# Altium schematic sheet SelfDrivingCar_SCH_MotorDriver.SchDoc
size A; DocumentNumber: 6; SheetNumber: 5; SheetTotal: 7
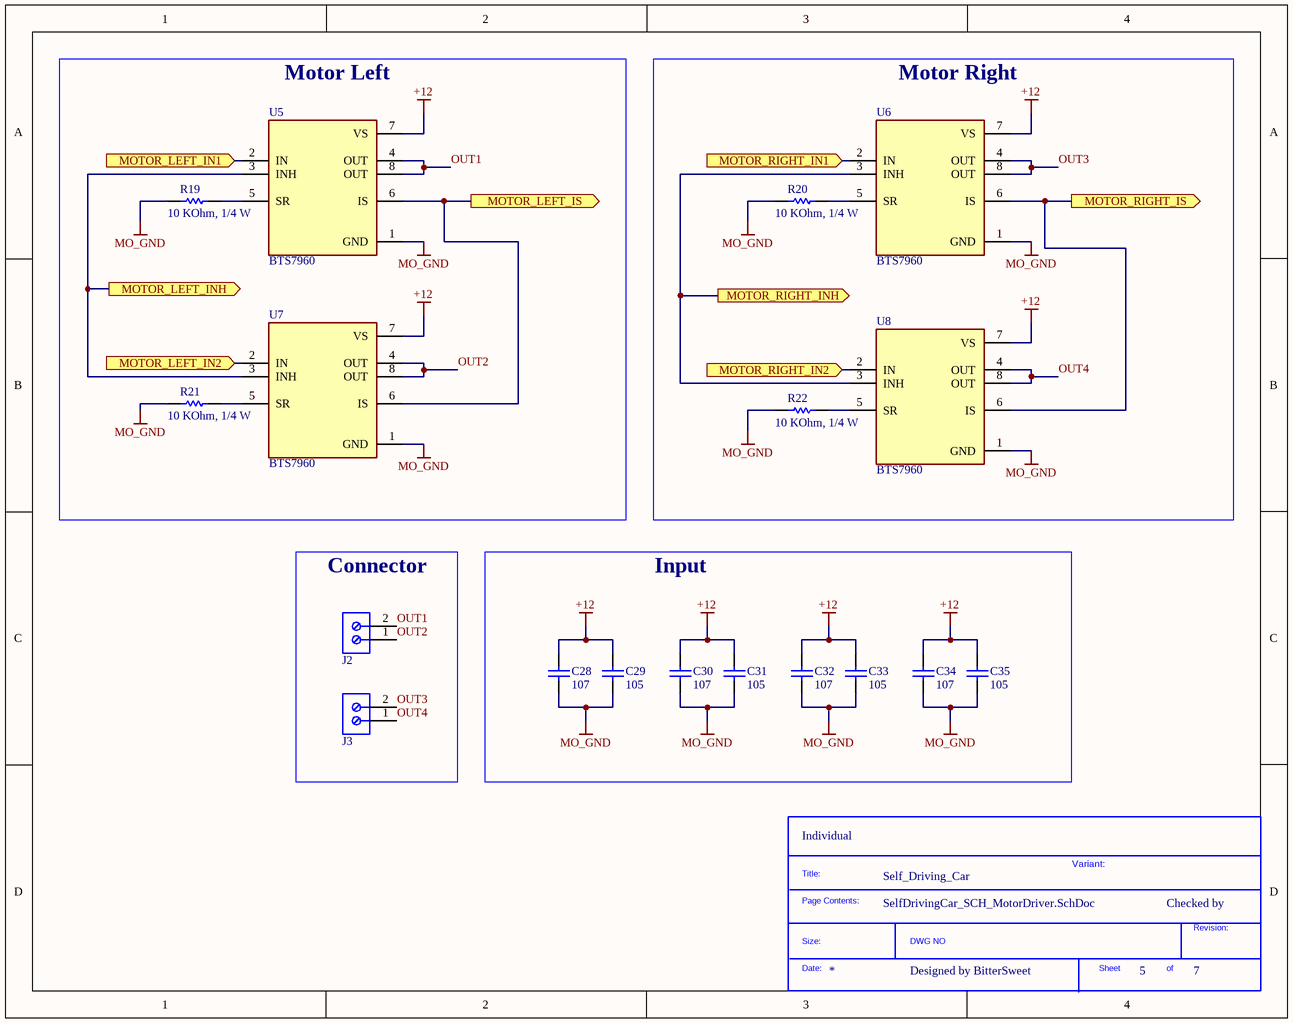
[diagram p0: SelfDrivingCar_SCH_MotorDriver.SchDoc]

## Parts
*?  SDTitleBlock  (value not drawn)  (graphical)
C28  107  [tu 1206]
C29  105  [tu 1206]
C30  107  [tu 1206]
C31  105  [tu 1206]
C32  107  [tu 1206]
C33  105  [tu 1206]
C34  107  [tu 1206]
C35  105  [tu 1206]
J2  16A, 300V  [691213710002]  (value not drawn)
J3  16A, 300V  [691213710002]  (value not drawn)
R19  10 KOhm, 1/4 W  [resistor_0603]
R20  10 KOhm, 1/4 W  [resistor_0603]
R21  10 KOhm, 1/4 W  [resistor_0603]
R22  10 KOhm, 1/4 W  [resistor_0603]
U5  BTS7960  [P-TO-263-7]
U6  BTS7960  [P-TO-263-7]
U7  BTS7960  [P-TO-263-7]
U8  BTS7960  [P-TO-263-7]

## Blocks framed on the sheet
Motor Left: R19 R21 U5 U7
Motor Right: R20 R22 U6 U8
Connector: J2 J3
Input: C28-C35

## Ports
MOTOR_LEFT_IN1 (in), MOTOR_LEFT_IN2 (in), MOTOR_LEFT_INH (out), MOTOR_LEFT_IS (out), MOTOR_RIGHT_IN1 (in), MOTOR_RIGHT_IN2 (in), MOTOR_RIGHT_INH (out), MOTOR_RIGHT_IS (out)

## Nets
+12: C28.1 C29.1 C30.1 C31.1 C32.1 C33.1 C34.1 C35.1 U5.7(VS) U6.7(VS) U7.7(VS) U8.7(VS)
MO_GND: C28.2 C29.2 C30.2 C31.2 C32.2 C33.2 C34.2 C35.2 R19.2 R20.2 R21.2 R22.2 U5.1(GND) U6.1(GND) U7.1(GND) U8.1(GND)
MOTOR_LEFT_IN1: U5.2(IN) ; port MOTOR_LEFT_IN1
MOTOR_LEFT_IN2: U7.2(IN) ; port MOTOR_LEFT_IN2
MOTOR_LEFT_INH: U5.3(INH) U7.3(INH) ; port MOTOR_LEFT_INH
MOTOR_LEFT_IS: U5.6(IS) U7.6(IS) ; port MOTOR_LEFT_IS
MOTOR_RIGHT_IN1: U6.2(IN) ; port MOTOR_RIGHT_IN1
MOTOR_RIGHT_IN2: U8.2(IN) ; port MOTOR_RIGHT_IN2
MOTOR_RIGHT_INH: U6.3(INH) U8.3(INH) ; port MOTOR_RIGHT_INH
MOTOR_RIGHT_IS: U6.6(IS) U8.6(IS) ; port MOTOR_RIGHT_IS
OUT1: J2.2 U5.4(OUT) U5.8(OUT)
OUT2: J2.1 U7.4(OUT) U7.8(OUT)
OUT3: J3.2 U6.4(OUT) U6.8(OUT)
OUT4: J3.1 U8.4(OUT) U8.8(OUT)
NetR19_1: R19.1 U5.5(SR)
NetR20_1: R20.1 U6.5(SR)
NetR21_1: R21.1 U7.5(SR)
NetR22_1: R22.1 U8.5(SR)

## Notes on the sheet
- (near *?) Individual
- Self_Driving_Car
- Variant:
- Checked by
- Designed by BitterSweet
- (in symbol SDTitleBlock) Title:; Page Contents:; Revision:; Size:; DWG NO; Date:; Sheet; of

## Library data of the parts
C28 C30 C32 C34 = Tu 1206 106 16V 20%: Dán; Don_Vi: Con; So_Chan: 2; Ten_Linh_Kien: Tụ 1207 106-10uF 20% 16V; Ma_Hang: MH004541; Chung_Loai: Dán; Kieu_Chan: *; ComponentLink1Description: URL; ComponentLink1URL: https://www.thegioiic.com/tu-gom-1206-10uf-16v
C29 C31 C33 C35 = Tu 1206 105 50V 20%: Dán; Don_Vi: Con; So_Chan: 2; Ten_Linh_Kien: Tụ 1206 105-1uF 20% 50V; Ma_Hang: MH004545; Chung_Loai: Dán; Kieu_Chan: *
J2 J3 = 691213710002: WR-TBL Series 213 Horizontal Entry Modular, THT, pitch 5mm, 2p; Manufacturer: Wurth Elektronik; Modularity: Yes; Rated Current: 10A; ComponentLink1Description: Datasheet Link; ComponentLink1URL: https://www.we-online.com/redexpert/spec/691213710002?ad; ComponentLink2Description: Supplier 1 URL; ComponentLink2URL: N/A; Manufacturer Part Number: 691213710002; Category: Terminal Blocks; Match Code: WR-TBL; Mount: Through Hole; Operating Temperature Max: 105°C; Operating Temperature Min: -40°C; Packaging: Box; Application: Rising Cage Clamp; Number of Pins: 2; Number of Rows: 1; Orientation: Horizontal; Pitch: 5mm; Working Voltage: 300V; ComponentLink3Description: Supplier 2 URL; ComponentLink3URL: N/A; ComponentLink4Description: Supplier 3 URL; ComponentLink4URL: https://www.thegioiic.com/kf128-2-v-domino-2-chan-thang-5mm-300v-10a-han-pcb-loai-tot; Supplier 1 Name: Mouser; Supplier 1 SN: N/A; Supplier 1 URL: N/A; Supplier 2 Name: Digi-Key; Supplier 2 SN: N/A; Supplier 2 URL: N/A; Supplier 3 Name: thegioiic; Supplier 3 SN: N/A; Supplier 3 URL: https://www.thegioiic.com/kf128-2-v-domino-2-chan-thang-5mm-300v-10a-han-pcb-loai-tot; Value: 16A, 300V
R19-R22 = 0006031031: RES, size 0603, 10 KOhm, 1/4 W; Manufacture  Name: OEM; Resistance: 10 KOhm; Rated Power: 1/4 W; Resistance Tolerance: +/-1%; Size: 0603; Mounting Technology: SMT; Supplier 1 Name: Mouser; Supplier 1 SN: 755-ESR03EZPF1002; Supplier 2 Name: Digi-Key; Supplier 2 SN: RHM10KADTR-ND RHM10KADCT-ND RHM10KADDKR-ND; Supplier 1 URL: https://www.mouser.vn/ProductDetail/ROHM-Semiconductor/ESR03EZPF1002?qs=sGAEpiMZZMvdGkrng054t67Efho1F8r6CDeAsqwFse8%3D; Supplier 3 Name: thegioiic; Supplier 3 SN: N/A; Supplier 3 URL: N/A; Manufacture  SN: OEM; Value: 10 KOhm, 1/4 W; ComponentLink1Description: Datasheet link; ComponentLink1URL: https://fscdn.rohm.com/en/products/databook/datasheet/passive/resistor/chip_resistor/esr-e.pdf; ComponentLink2Description: Supplier 1 URL; ComponentLink2URL: N/A; ComponentLink3Description: Supplier 2 URL; ComponentLink3URL: https://www.digikey.com/en/products/detail/rohm-semiconductor/ESR03EZPF1002/1983429; ComponentLink4Description: Supplier 3 URL; ComponentLink4URL: N/A; Supplier 2 URL: https://www.digikey.com/en/products/detail/rohm-semiconductor/ESR03EZPF1002/1983429
U6 = BTS7960: IC Control motor
U5 U7 U8 = BTS7960: ComponentLink1Description: URL; ComponentLink1URL: https://www.thegioiic.com/bts7960-ic-dieu-khien-dong-co-dc-27-5v-40a-to-263-7